# Altium schematic sheet BT_806.SchDoc
size 304 x 241 mm; PageSetup: Record=PageOptions|CenterHorizontal=True|CenterVertical=True|PrintScale=0.88|XCorrection=1.00|YCorrection=1.00|PrintKind=2|BorderSize=5000000|LeftOffset=0|BottomOffset=0|Orientation=2|PaperLength=1000|PaperWidth=1000|Scale=100|PaperSource=7|PrintQuality=-3|MediaType=1|DitherType=10|PrintScaleMode=1|PaperKind=Letter|PaperIndex=1
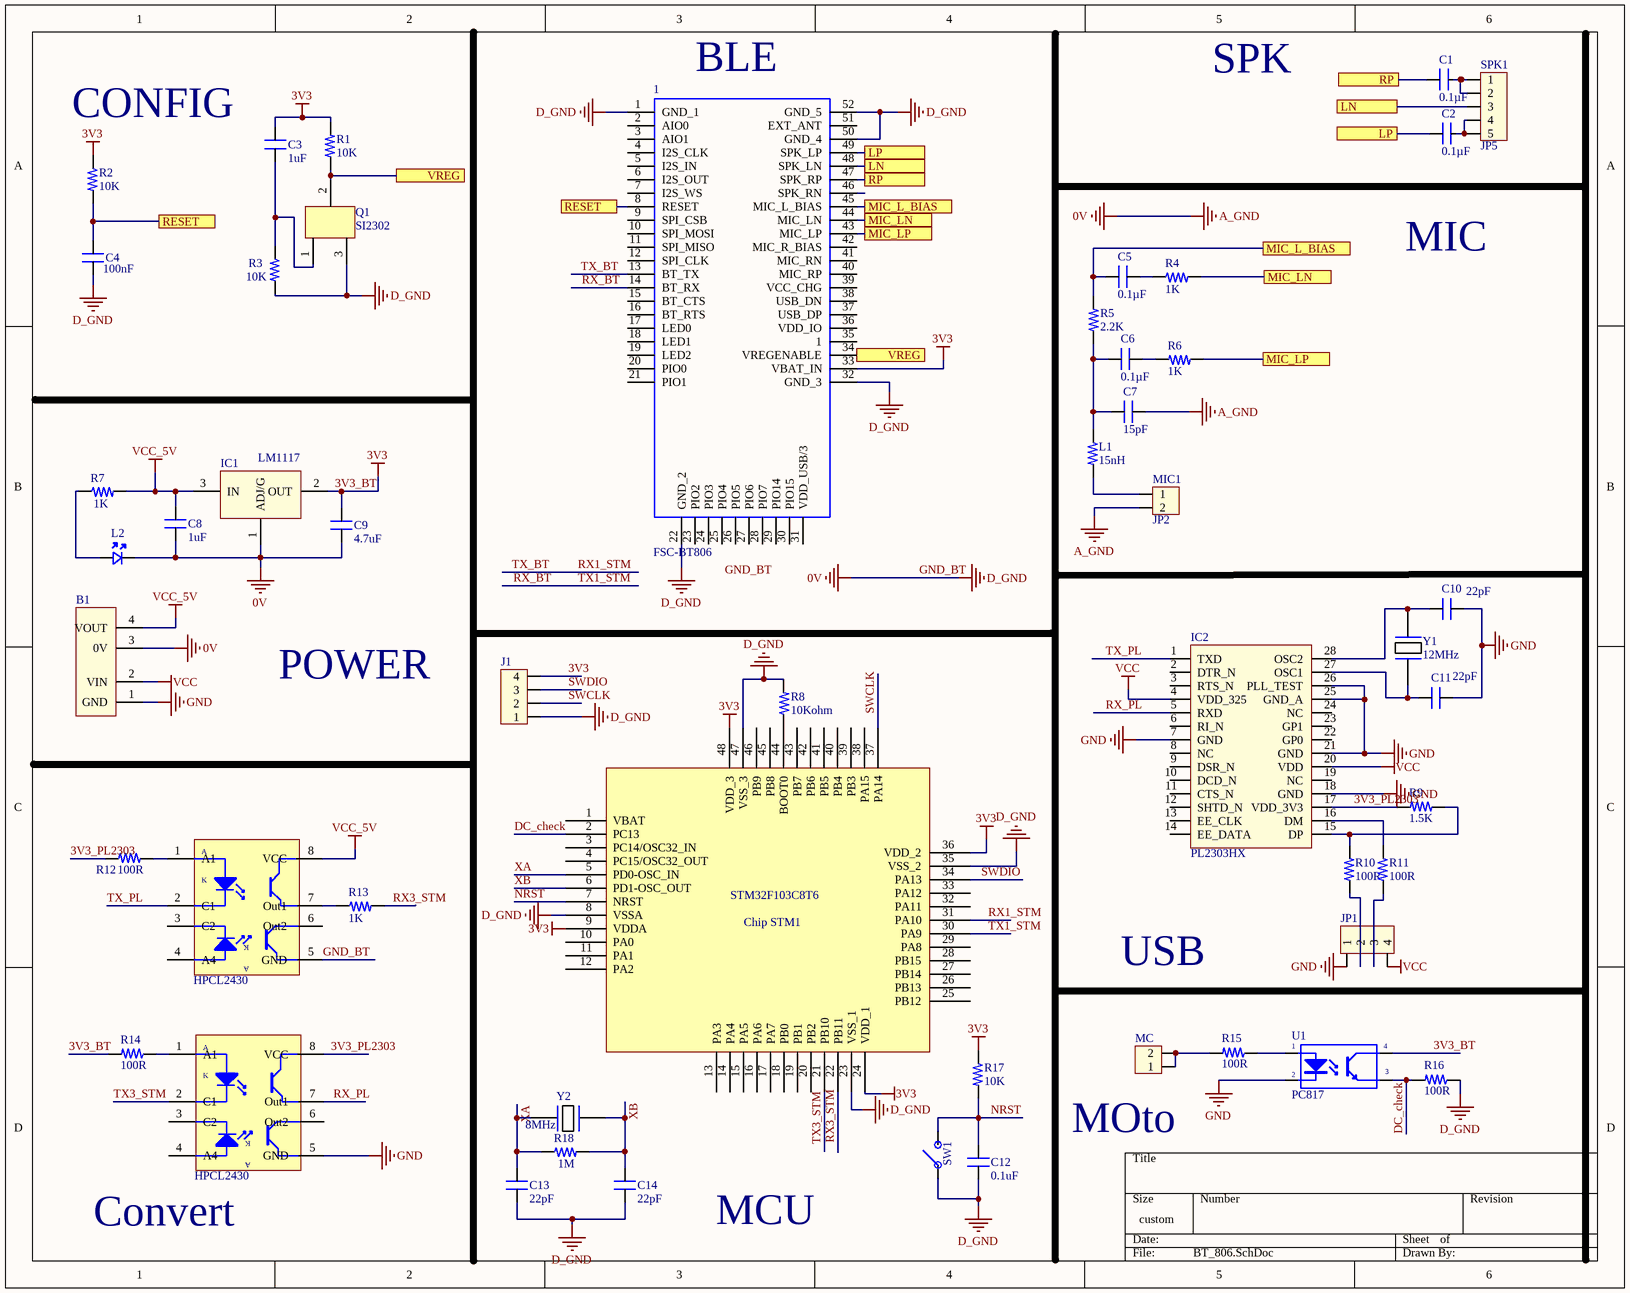
[diagram p0: BT_806.SchDoc]

## Parts
1  FSC-BT806  [FSCBT806]
*2  HPCL2430  [HPCL_A2430]
*3  HPCL2430  [HPCL_A2430]
B1  (no value)  [B0505S]
C1  0.1µF  [CAP_0805]
C2  0.1µF  [CAP_0805]
C3  1uF  [CAP_0805]
C4  100nF  [CAP_0805]
C5  0.1µF  [CAP_0805]
C6  0.1µF  [CAP_0805]
C7  15pF  [CAP_0805]
C8  1uF  [CAP_0805]
C9  4.7uF  [CAP_0805]
C10  22pF  [CAP_0805]
C11  22pF  [CAP_0805]
C12  0.1uF  [CAP_0805]
C13  22pF  [CAP_0805]
C14  22pF  [CAP_0805]
Chip_STM1  STM32F103C8T6  [LQFP-48_19.6_393_58X11_SMD]
IC1  LM1117  [SOT223-4N]
IC2  PL2303HX  [PL2303]
J1  (no value)  [CON4]
JP1  (no value)  [CON4]
L1  15nH  [RES_0805]
L2  (no value)  [LED_0805]
MC  (no value)  [CON2]
MIC1  JP2  [CON2]
Q1  SI2302  [SOT23A]
R1  10K  [RES_0805]
R2  10K  [RES_0805]
R3  10K  [RES_0805]
R4  1K  [RES_0805]
R5  2.2K  [RES_0805]
R6  1K  [RES_0805]
R7  1K  [RES_0805]
R8  10Kohm  [RES_0805]
R9  1.5K  [RES_0805]
R10  100R  [RES_0805]
R11  100R  [RES_0805]
R12  100R  [RES_0805 - Dup]
R13  1K  [RES_0805]
R14  100R  [RES_0805 - Dup]
R15  100R  [RES_0805]
R16  100R  [RES_0805]
R17  10K  [RES_0805]
R18  1M  [RES_0805]
SPK1  JP5  [CON5]
SW1  (no value)  [SW_342_SMD]
U1  PC817  [DIP4/W0.3]
Y1  12MHz  [XTAL_314_240X47_SMD]
Y2  8MHz  [XTAL_314_240X47_SMD]

## Ports
LN, LP, MIC_L_BIAS, MIC_LN, MIC_LP, RESET, RP, VREG

## Nets
3V3: 1.33(VBAT_IN) C3.2 C9.2 Chip_STM1.9(VDDA) Chip_STM1.24(VDD_1) Chip_STM1.36(VDD_2) Chip_STM1.48(VDD_3) IC1.2(OUT) J1.4 R1.2 R2.2 R14.1 R17.2 U1.4(C)  [also labelled 3V3_BT]
GND: *3.5(GND) B1.1(GND) C10.2 C11.1 IC2.7(GND) IC2.18(GND) IC2.21(GND) IC2.25(GND_A) IC2.26(PLL_TEST) JP1.1 U1.2(K)
GND_BT: 1.1(GND_1) 1.22(GND_2) 1.32(GND_3) 1.50(GND_4) 1.52(GND_5) *2.5(GND) B1.3(0V) C4.1 C7.2 C8.1 C9.1 C12.1 C13.1 C14.1 Chip_STM1.8(VSSA) Chip_STM1.23(VSS_1) Chip_STM1.35(VSS_2) Chip_STM1.47(VSS_3) IC1.1(ADJ/G) J1.1 L2.K MIC1.2 Q1.3 R3.1 R8.1 R16.2 SW1.1  [also labelled 0V, A_GND, D_GND]
VCC: B1.2(VIN) IC2.4(VDD_325) IC2.20(VDD) JP1.4
VCC_5V: *2.8(VCC) B1.4(VOUT) C8.2 IC1.3(IN) R7.1
3V3_PL2303: *3.8(VCC) IC2.17(VDD_3V3) R9.1 R12.1
DC_check: Chip_STM1.2(PC13) R16.1 U1.3(E)
LN: 1.48(SPK_LN) SPK1.3 ; port LN
LP: 1.49(SPK_LP) C2.1 ; port LP
MIC_L_BIAS: 1.45(MIC_L_BIAS) C5.1 R5.1 ; port MIC_L_BIAS
MIC_LN: 1.44(MIC_LN) R4.1 ; port MIC_LN
MIC_LP: 1.43(MIC_LP) R6.1 ; port MIC_LP
NRST: C12.2 Chip_STM1.7(NRST) R17.1 SW1.2
RESET: 1.8(RESET) C4.2 R2.1 ; port RESET
RP: 1.47(SPK_RP) C1.1 ; port RP
RX1_STM: 1.13(BT_TX) Chip_STM1.31(PA10)  [also labelled TX_BT]
RX3_STM: Chip_STM1.22(PB11) R13.1
RX_BT: 1.14(BT_RX) Chip_STM1.30(PA9)  [also labelled TX1_STM]
RX_PL: *3.7(Out1) IC2.5(RXD)
SWCLK: Chip_STM1.37(PA14) J1.2
SWDIO: Chip_STM1.34(PA13) J1.3
TX3_STM: *3.2(C1) Chip_STM1.21(PB10)
TX_PL: *2.2(C1) IC2.1(TXD)
VREG: 1.34(VREGENABLE) Q1.2 R1.1 ; port VREG
XA: C13.2 Chip_STM1.5(PD0-OSC_IN) R18.2 Y2.1
XB: C14.2 Chip_STM1.6(PD1-OSC_OUT) R18.1 Y2.2
Net*2_1: *2.1(A1) R12.2
Net*2_7: *2.7(Out1) R13.2
Net*3_1: *3.1(A1) R14.2
NetC1_2: C1.2 SPK1.1 SPK1.2
NetC2_2: C2.2 SPK1.4 SPK1.5
NetC3_1: C3.1 Q1.1 R3.2
NetC5_2: C5.2 R4.2
NetC6_1: C6.1 C7.1 L1.2 R5.2
NetC6_2: C6.2 R6.2
NetC10_1: C10.1 IC2.28(OSC2) Y1.2
NetC11_2: C11.2 IC2.27(OSC1) Y1.1
NetChip_STM1_44: Chip_STM1.44(BOOT0) R8.2
NetIC2_15: IC2.15(DP) R9.2 R10.2
NetIC2_16: IC2.16(DM) R11.2
NetJP1_2: JP1.2 R10.1
NetJP1_3: JP1.3 R11.1
NetL1_1: L1.1 MIC1.1
NetL2_A: L2.A R7.2
NetMC_1: MC.1 MC.2 R15.1
NetR15_2: R15.2 U1.1(A)

Not connected (* = marked no-connect by the designer): 1 2(AIO0) 3(AIO1) 4(I2S_CLK) 5(I2S_IN) 6(I2S_OUT) 7(I2S_WS) 9(SPI_CSB) 10(SPI_MOSI) 11(SPI_MISO) 12(SPI_CLK) 15(BT_CTS) 16(BT_RTS) 17(LED0) 18(LED1) 19(LED2) 20(PIO0) 21(PIO1) 23(PIO2) 24(PIO3) 25(PIO4) 26(PIO5) 27(PIO6) 28(PIO7) 29(PIO14) 30(PIO15) 31(VDD_USB/3) 35(1) 36(VDD_IO) 37(USB_DP) 38(USB_DN) 39(VCC_CHG) 40(MIC_RP) 41(MIC_RN) 42(MIC_R_BIAS) 46(SPK_RN) 51(EXT_ANT); *2 3(C2) 4(A4) 6(Out2); *3 3(C2) 4(A4) 6(Out2); Chip_STM1 1(VBAT) 3(PC14/OSC32_IN) 4(PC15/OSC32_OUT) 10(PA0) 11(PA1) 12(PA2) 13(PA3) 14(PA4) 15(PA5) 16(PA6) 17(PA7) 18(PB0) 19(PB1) 20(PB2) 25(PB12) 26(PB13) 27(PB14) 28(PB15) 29(PA8) 32(PA11) 33(PA12) 38(PA15) 39(PB3) 40(PB4) 41(PB5) 42(PB6) 43(PB7) 45(PB8) 46(PB9); IC2 2(DTR_N) 3(RTS_N) 6(RI_N) 8(NC) 9(DSR_N) 10(DCD_N) 11(CTS_N) 12(SHTD_N) 13(EE_CLK) 14(EE_DATA) 19(NC) 22(GP0) 23(GP1) 24(NC)

## Notes on the sheet
- (near 1) BLE
- SPK
- (near R2) CONFIG
- MIC
- POWER
- USB
- (near MC) MOto
- (near *3) Convert
- MCU
- Labels drawn without touching a wire or pin: GND_BT
- (in symbol HPCL2430) A; K

## Library data of the parts
B1 = B0505S: 5V to 5V
C1 C2 C5-C7 C12 = CAP_0.1uF-50V-5%-0805: 0.1µF ±5% 50V Ceramic Capacitor X7R 0805 (2012 Metric); Manufacturer: KEMET; Manufacturing Part Number: C0805C104J5RACTU; Case/Package: 0805 (2012 Metric); Supplier-1: Digikey; Supplier Part Number-1: 399-1171-1-ND
C3 C8 = CAP_1uF-50V-5%-0805: 1µF ±5% 50V Ceramic Capacitor X7R 0805 (2012 Metric); Manufacturer: Yageo; Manufacturing Part Number: CC0805JKX7R9BB105; Case/Package: 0805 (2012 Metric); Supplier-1: Digikey; Supplier Part Number-1: 311-3498-1-ND
C4 = CAP_1uF-50V-5%-0805: 100µF ±5% 50V Ceramic Capacitor X7R 0805 (2012 Metric); Manufacturer: Yageo; Manufacturing Part Number: CC0805JKX7R9BB105; Case/Package: 0805 (2012 Metric); Supplier-1: Digikey; Supplier Part Number-1: 311-3498-1-ND
C9 = CAP_1uF-50V-5%-0805: 4.7µF ±5% 50V Ceramic Capacitor X7R 0805 (2012 Metric); Manufacturer: Yageo; Manufacturing Part Number: CC0805JKX7R9BB105; Case/Package: 0805 (2012 Metric); Supplier-1: Digikey; Supplier Part Number-1: 311-3498-1-ND
C10 C11 C13 C14 = CAP_22pF-50V-5%-0805: 22pF ±5% 50V Ceramic Capacitor C0G, NP0 0805 (2012 Metric); Manufacturer: KEMET; Manufacturer Part Number: C0805C220J5GACTU; Case/Package: 0805; Supplier-1: Digikey; Supplier Part Number-1: 399-1113-1-ND
Chip_STM1 = IC-STM32F103C8T6 _1: ARM® Cortex®-M3 STM32F1 Microcontroller IC 32-Bit 72MHz 64KB (64K x 8) FLASH; Manufacturer: STMicroelectronics; Manufacturer Part Number: STM32F103C8T6; Case/Package: 48-LQFP; Supplier-1: Digikey; Supplier Part Number-1: 497-6063-ND
IC1 = LM1117: Available in 1.8V, 2.5V, 2.85V, 3.3V, 5V, and  Adjustable Versions; Value: LM317
IC2 = PL2303HX: USB - RS232 Converter; Value: PL2303
J1 JP1 = Con4: Connector 4; Value: Connector 4
L1 = RES_1K-0.125W-1%-0805: Conductor 15nH; Manufacturer: 垈㎵á; Manufacturer Part Number: RC0805FR-071KL; Case/Package: 0805; Supplier-1: Digikey; Supplier Part Number-1: 311-1.00KCRCT-ND
L2 = LED-RED_10mA-0805: Red 621nm LED Indication - Discrete 2V 0805 (2012 Metric); Manufacturer: Lite-On Inc.; Manufacturer Part Number: LTST-C170EKT; Case/ Package: 0805; Supplier-1: Digikey; Supplier Part Number-1: 160-1178-1-ND
MC MIC1 = Con2: Connector 2; Value: Connector 2
Q1 = DV3
R1-R4 R6 = RES_10K-0.125W-1%-0805_1: 10 kOhms ±1% 0.125W, 1/8W Chip Resistor 0805 (2012 Metric) Moisture Resistant Thick Film; Manufacturer: Yageo; Manufacturing Part Number: RC0805FR-0710KL; Case/Package: 0805; Supplier-1: Digikey; Supplier Part Number-1: 311-10.0KCRCT-ND
R5 = RES_10K-0.125W-1%-0805_1: 2.2kOhms ±1% 0.125W, 1/8W Chip Resistor 0805 (2012 Metric) Moisture Resistant Thick Film; Manufacturer: Yageo; Manufacturing Part Number: RC0805FR-0710KL; Case/Package: 0805; Supplier-1: Digikey; Supplier Part Number-1: 311-10.0KCRCT-ND
R7 R13 = RES_10K-0.125W-1%-0805_1: 1 kOhms ±1% 0.125W, 1/8W Chip Resistor 0805 (2012 Metric) Moisture Resistant Thick Film; Manufacturer: Yageo; Manufacturing Part Number: RC0805FR-0710KL; Case/Package: 0805; Supplier-1: Digikey; Supplier Part Number-1: 311-10.0KCRCT-ND
R8 = RES_10K-0.125W-1%-0805: 10 kOhms ±1% 0.125W, 1/8W Chip Resistor 0805 (2012 Metric) Moisture Resistant Thick Film; Manufacturer: Yageo; Manufacturing Part Number: RC0805FR-0710KL; Case/Package: 0805; Supplier-1: Digikey; Supplier Part Number-1: 311-10.0KCRCT-ND
R9 = RES_1.5K-0.125W-1%-0805: 1.5 kOhms ±1% 0.125W, 1/8W Chip Resistor 0805 (2012 Metric) Thick Film; Manufacturer: TE Connectivity Passive Product; Manufacturing Part Number: CRG0805F1K5; Case/Package: 0805; Supplier-1: Digikey; Supplier Part Number-1: A106057CT-ND
R10 R11 = RES_0ohm-0.125W-1%-0805_1: 1000Ohms ±1% 0.125W, 1/8W Chip Resistor 0805 (2012 Metric) Moisture Resistant Thick Film; Manufacturer: 垈㎵á; Manufacturer Part Number: RC0805FR-071KL; Case/Package: 0805; Supplier-1: Digikey; Supplier Part Number-1: 311-1.00KCRCT-ND
R12 = RES_10K: Resistor 10K value Chip Resistor 0805 Moisture Resistant Thick Film; Manufacturer: 垈㎵á; Manufacturer Part Number: RC0805FR-071KL; Case/Package: 0805; Supplier-1: Digikey; Supplier Part Number-1: 311-1.00KCRCT-ND
R14 = RES_10K: Resistor 100R value Chip Resistor 0805 Moisture Resistant Thick Film; Manufacturer: 垈㎵á; Manufacturer Part Number: RC0805FR-071KL; Case/Package: 0805; Supplier-1: Digikey; Supplier Part Number-1: 311-1.00KCRCT-ND
R15 R16 = RES_1K-0.125W-1%-0805: 1 kOhms ±1% 0.125W, 1/8W Chip Resistor 0805 (2012 Metric) Moisture Resistant Thick Film; Manufacturer: 垈㎵á; Manufacturer Part Number: RC0805FR-071KL; Case/Package: 0805; Supplier-1: Digikey; Supplier Part Number-1: 311-1.00KCRCT-ND
R17 = RES_10MOHM-0.125W-1%-0805: 10K ±1% 0.125W, 1/8W Chip Resistor 0805 (2012 Metric) Automotive AEC-Q200, High Voltage Thick Film; Manufacturer: Rohm Semiconductor; Manufacturing Part Number: KTR10EZPF1005; Case/Package: 0805 (2012 Metric); Supplier-1: Digikey; Supplier Part Number-1: RHM10.0MAHCT-ND
R18 = RES_10MOHM-0.125W-1%-0805: 1 MOhms ±1% 0.125W, 1/8W Chip Resistor 0805 (2012 Metric) Automotive AEC-Q200, High Voltage Thick Film; Manufacturer: Rohm Semiconductor; Manufacturing Part Number: KTR10EZPF1005; Case/Package: 0805 (2012 Metric); Supplier-1: Digikey; Supplier Part Number-1: RHM10.0MAHCT-ND
SPK1 = Con5: Connector 5; Value: Connector 5
SW1 = SW_KSR223GLFG-SMD: Tactile Switch SPST-NO Top Actuated Surface Mount; Manufacturer: C&K; Manufacturing Part Number: KSR223GLFG; Case/Package: SMD; Supplier-1: Digikey; Supplier Part Number-1: 401-1704-1-ND
U1 = PC817: Single Opto; Value: PC817
Y1 Y2 = XTAL_8MHZ-LFXTAL030234: Crystals 8MHz 22pF -20C 70C; Manufacturer: IQD Frequency Products; Manufacturing Part Number: LFXTAL030234Reel; Case/Package: SMD; Supplier-1: Mouser; Supplier Part Number-1: 449-LFXTAL030234REEL